# EAGLE design 18650_1S1P_PTH (EAGLE 9.6.2)
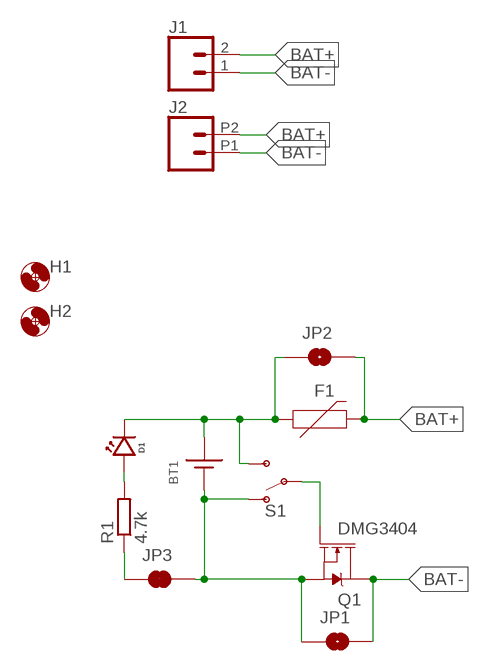
[diagram p0: schematic, sheet 1]

## Parts
BT1  18650NO_PROTEC  [BATT_18650_CLIP]
D1  LED0603  [LED_0603]
F1  PPTC1.75A1210  [1210_BOURNS]
H1  MOUNTING_HOLE4_NP  [4_40]
H2  MOUNTING_HOLE4_NP  [4_40]
J1  CONN_023.5MM_ROUND_RESTRICT  [SCREWTERMINAL-3.5MM-2_ROUND_RESTRICT]
J2  CONN_022.54_SCREW_ROUND  [1X02_2.54_SCREWTERM_ROUND]
JP1  JUMPER-SMT_2_NO_SILK  [SMT-JUMPER_2_NO_SILK]
JP2  JUMPER-SMT_2_NO_SILK  [SMT-JUMPER_2_NO_SILK]
JP3  JUMPER-SMT_2_NC_TRACE_SILK  [SMT-JUMPER_2_NC_TRACE_SILK]
Q1  DMG3404  MOSFET-NCH-DMG3404L  [SOT23-3]
R1  4.7k  R-EU_4.7KR0603  [R0603]
S1  SPDTOS1020  [OS102011MS2QN1]

## Nets
BAT+: F1.2 J1.2 J2.P2 JP2.2
BAT-: J1.1 J2.P1 JP1.2 Q1.3(D)
N$1: BT1.BATT+@1(+) BT1.BATT+@2(+) BT1.BATT+@3(+) D1.CATHODE F1.1 JP2.1 S1.3(S)
N$2: D1.ANODE R1.2
N$3: Q1.1(G) S1.2(P)
N$4: BT1.BATT-@1(-) BT1.BATT-@2(-) BT1.BATT-@3(-) JP1.1 JP3.2 Q1.2(S) S1.1(O)
N$5: JP3.1 R1.1

## Library data of the parts
BT1 = bschulz:18650: Battery Holder 18650 form factor Variant for with or without circuit protection (length varries depending on this); DIGIKEY: 36-54-ND; MF: Keystone; MPN: 54
D1 = bschulz:LED: Genaric LED
F1 = bschulz:PPTC: Bel Fuse PPTC; DIGIKEY: MF-USMF175X-2CT-ND; MF: Bourns; MPN: MF-USMF175X-2
H1 H2 = bschulz:MOUNTING_HOLE: Genaric Mechanical Mounting Hole Hole diameter based on max body diameter + 15% Keepout ring is for diameter of socket cap screw (minimum required clearance) TPlace ring is for diameter of pan head screw (recomended clearance) Specifications: Socket Cap <http://fastener-express.com/fastener-technical/SocketscapSS-Alloy.pdf> Button Head Socket Cap <http://fastener-express.com/fastener-technical/Button-Socket-alloy.pdf> Pan Head <http://fastener-express.com/fastener-technical/pan-machine-Screws.pdf>; DIGIKEY: DNP; MF: N/A; MPN: DNP
J1 = bschulz:CONN_02: Genaric 2 terminal header SCREW_2.54 <https://www.digikey.com/product-detail/en/on-shore-technology-inc/OSTVN02A150/ED10561-ND/1588862> 39532_RA <https://www.digikey.com/product-detail/en/molex/0395321002/WM7845-ND/1280696>; DIGIKEY: ED2635-ND; MF: On Shore; MPN: OSTTE020161
J2 = bschulz:CONN_02: Genaric 2 terminal header SCREW_2.54 <https://www.digikey.com/product-detail/en/on-shore-technology-inc/OSTVN02A150/ED10561-ND/1588862> 39532_RA <https://www.digikey.com/product-detail/en/molex/0395321002/WM7845-ND/1280696>; DIGIKEY: ED10561-ND; MF: OnShore; MPN: OSTVN02A150
JP1 JP2 = bschulz:JUMPER-SMT_2_NO: Normally open jumper This jumper has two pads in close proximity to each other. Apply solder to close the connection. Round pads are easier to solder for beginners, but are a lot larger. SparkFun Product that uses the round pads: SparkFun EL Sequencer <https://www.sparkfun.com/products/12781>; DIGIKEY: DNP; MF: N/A; MPN: N/A
JP3 = bschulz:JUMPER-SMT_2_NC_TRACE: Normally closed trace jumper This jumper has a trace between two pads so it's normally closed (NC). Use a razor knife to open the connection. For best results follow the IPC guidelines for cutting traces: Cutout at least 0.063 mm (0.005 in). Remove all loose material to clean up the cut area. Seal the cut with an approved epoxy. Reapply solder to reclose the connection.
Q1 = bschulz:MOSFET-NCH: N-channel MOSFETs Voltage controlled devices that allow control of high current outputs. SparkFun Products: SparkFun OpenScale <https://www.sparkfun.com/products/13261> SparkFun Digital Sandbox <https://www.sparkfun.com/products/12651> SparkFun Monster Moto Shield <https://www.sparkfun.com/products/10182> SparkFun MOSFET Power Controller <https://www.sparkfun.com/products/11214>; DIGIKEY: DMG3404L-7DICT-ND; MF: Diodes Incorporated; MPN: DMG3404L-7
R1 = bschulz_passives:R-EU_: RESISTOR, European symbol Digikey Parts: Yageo, 0402 <https://www.digikey.com/products/en/resistors/chip-resistor-surface-mount/52?k=&pkeyword=&sv=0&s=4356&sf=1&FV=-1%7C13%2C7%7C2%2C1291%7C39157%2C1989%7C0%2C-8%7C52%2C3%7C1131%2C3%7C2503&quantity=&ColumnSort=0&page=1&stock=1&pageSize=25> Yageo, 0603 <https://www.digikey.com/products/en/resistors/chip-resistor-surface-mount/52?k=&pkeyword=&sv=0&pv1291=39245&sf=1&FV=-5%7C4356%2C-5%7C47360%2C-8%7C52%2C-1%7C13%2C7%7C2%2C1989%7C0&quantity=10&ColumnSort=1000011&page=1&stock=1&pageSize=25> Panasonic, 0603 <https://www.digikey.com/products/en/resistors/chip-resistor-surface-mount/52?k=&pkeyword=&pv252=68&sf=0&FV=ffec373d%2C1c0002%2C142c040c%2C1f140000%2Cffe00034%2C80002%2Cc0001&quantity=&ColumnSort=0&page=1&stock=1&pageSize=25> Panasonic, precision, 0603 <https://www.digikey.com/products/en/resistors/chip-resistor-surface-mount/52?FV=ffec4907%2Cfffc000a%2Cc0172%2C142c040c%2C1f140000%2Cffe00034%2C1c0002&quantity=100&ColumnSort=2085&page=1&stock=1&pageSize=25> Panasonic, 0805 <https://www.digikey.com/products/en/resistors/chip-resistor-surface-mount/52?k=&pkeyword=&pv3=1&sf=0&FV=ffec373d%2C1c0002%2C1f140000%2Cffe00034%2C142c040d&quantity=&ColumnSort=0&page=1&stock=1&pageSize=25> Rohm, current sense <https://www.digikey.com/products/en/resistors/chip-resistor-surface-mount/52?k=&pkeyword=&pv3=1&sf=0&FV=ffecb688%2C1f140000%2Cffe00034%2C1c0002&quantity=&ColumnSort=0&page=1&stock=1&pageSize=25> Vishay, pulse proof automotive <https://www.digikey.com/products/en/resistors/chip-resistor-surface-mount/52?k=&pkeyword=&pv7=2&sf=0&FV=ffec5d6b%2Cffe00034%2C1f140000&quantity=&ColumnSort=0&page=1&stock=1&pageSize=25>; DIGIKEY: 311-4.70KHRCT-ND; MF: Yageo; MPN: RC0603FR-074K7L; VALUE_PART: 4.7k
S1 = bschulz:SPDT: Genaric SPDT switch

## Board
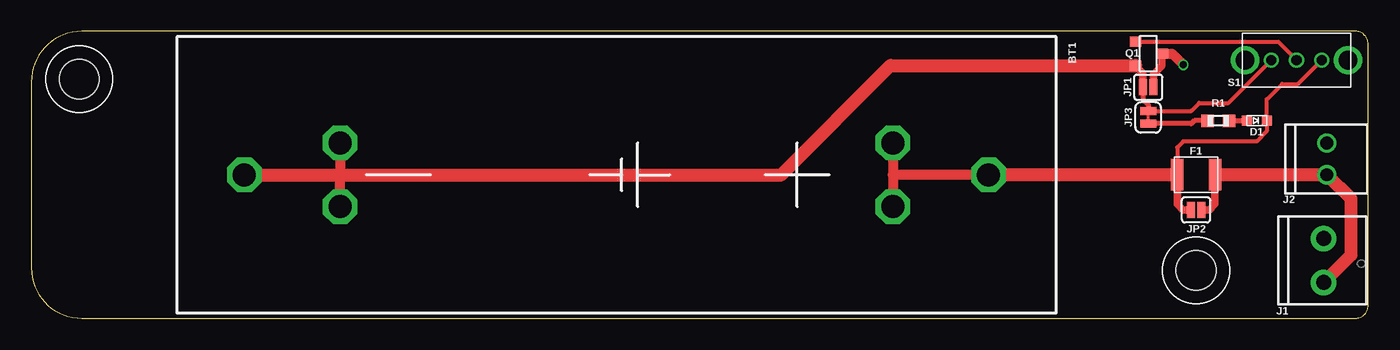
[diagram p1: board, top side]
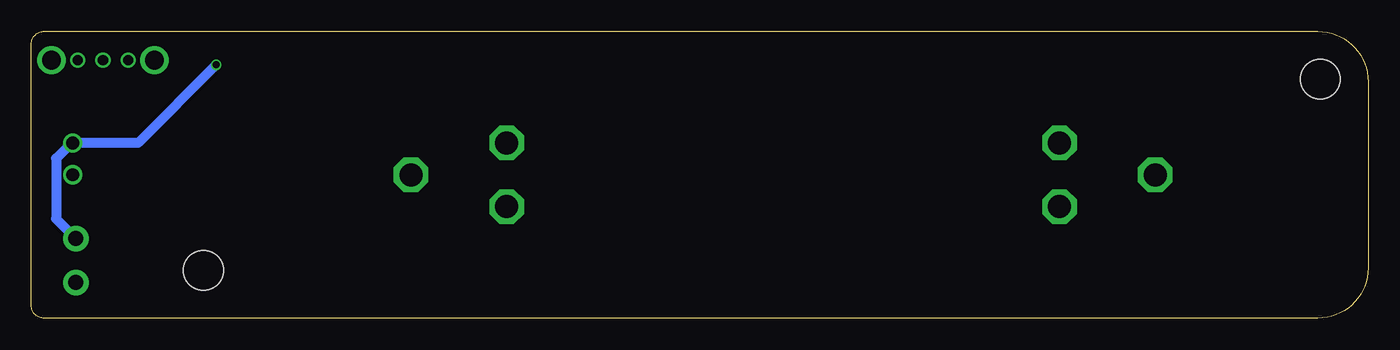
[diagram p2: board, bottom side, seen from below]

Size 106.41 x 22.86 mm. Coordinates in mm from the lower left corner, seen from the top.
Outline: 0,18.86 0,4 arc90 4,0 105.41,0 arc90 106.41,1 106.41,21.86 arc90 105.41,22.86 4,22.86 arc90 0,18.86
Copper layers (1*16): Top 0.035559375mm / dielectric 1.6mm / Bottom 0.035559375mm
Design rules "oshpark-2layer": minimum track width 6mil, minimum drill 10mil, track to track 6mil, track to pad 6mil, pad to pad 6mil, via to via 6mil, smd to smd 6mil, copper to edge 15mil, drill to drill 6mil, minimum pad ring 5mil, minimum via ring 5mil, stop-mask expansion 2.5mil, vias tented up to drill 0mil, thermal gap 10mil

### Footprints (pad centres in the part's own frame; a part is rotated, then mirrored left to right if it is on the bottom)
BATT_18650_CLIP = drill 1.83 octagon: BATT+@1 0,0; BATT+@2 7.62,2.54; BATT+@3 7.62,-2.54; BATT-@1 59.246,0; BATT-@2 51.626,2.54; BATT-@3 51.626,-2.54
LED_0603 = smd 0.8 x 0.8: ANODE 0.8,0; CATHODE -0.8,0
1210_BOURNS = smd 1 x 2.5: 1 -1.5,0; 2 1.5,0
4_40 = hole 3.175: 0,0
SCREWTERMINAL-3.5MM-2_ROUND_RESTRICT = drill 1.2 pad 2.032: 1 0,0; 2 3.5,0
1X02_2.54_SCREWTERM_ROUND = drill 1.016: P1 1.27,0; P2 -1.27,0
SMT-JUMPER_2_NO_SILK = smd 0.635 x 1.27: 1 -0.406,0; 2 0.406,0
SMT-JUMPER_2_NC_TRACE_SILK = smd 0.635 x 1.27: 1 -0.508,0; 2 0.508,0
SOT23-3 = smd 0.8 x 0.9: 1 -0.95,-1; 2 0.95,-1; 3 0,1.1
R0603 = smd 1 x 1: 1 -0.85,0; 2 0.85,0
OS102011MS2QN1 = drill 0.8: 1 -2,0; 2 0,0; 3 2,0 | drill 1.5: BODY@1 -4.1,0; BODY@2 4.1,0

### Placement (x,y rotation side)
BT1  76.2,11.43 180 top
D1  97.54,15.75 180 top
F1  92.71,11.43 0 top
H1  92.71,3.81 0 top
H2  3.81,19.05 0 top
J1  102.87,6.35 270 top
J2  103.12,12.7 90 top
JP1  88.9,18.41 0 top
JP2  92.71,8.64 0 top
JP3  88.9,16 90 top
Q1  88.9,21.08 270 top
R1  94.49,15.75 0 top
S1  100.71,20.57 0 top

### Tracks (layer width: path | path; a pad name or v marks a point on that pad's centre or on a via)
BAT+
  Top 0.61: JP2.2 93.75,8.64 94.21,9.1 F1.2
  Top 1.016: F1.2 J2.P2 105.03,9.53 105.03,5.01 J1.2
BAT-  (via drill 0.55)
  Top 0.61: JP1.2 89.31,19.43 90,20.12 Q1.3
  Top 0.813: Q1.3 90.81,21.08 v91.69,20.19
  Bottom 0.813: v91.69,20.19 97.92,13.97 J2.P1 103.21,13.97 104.44,12.74 104.44,7.92 J1.1
N$1
  Top 0.305: F1.1 91.21,13.61 91.69,14.1 97.54,14.1 98.34,14.9 D1.CATHODE 98.34,17.44 99.57,18.67 100.81,18.67 S1.3
  Top 0.61: JP2.1 91.67,8.64 91.21,9.1 F1.1
  Top 0.813: BT1.BATT+@3 68.58,11.43 | 68.58,11.43 BT1.BATT+@2 | BT1.BATT+@1 68.58,11.43
  Top 1.016: F1.1 BT1.BATT+@1
N$2
  Top 0.406: R1.2 D1.ANODE
N$3
  Top 0.305: Q1.1 87.93,22 99.28,22 S1.2
N$4
  Top 0.305: JP3.2 92.33,16.51 92.96,17.14 95.28,17.14 S1.1
  Top 0.406: JP1.1 88.49,17.42 88.9,17.02 JP3.2
  Top 0.61: JP1.1 88.49,19.54 Q1.2
  Top 0.813: BT1.BATT-@3 24.57,11.49 | 24.57,11.49 24.64,11.43 | BT1.BATT-@2 24.57,11.49
  Top 1.016: Q1.2 68.39,20.13 59.69,11.43 24.64,11.43 BT1.BATT-@1
N$5
  Top 0.406: R1.1 92.58,15.75 92.33,15.49 JP3.1

### Text on the board
tDocu: OFF | ON | - | + | - | +
bDocu: 1S1P - 18650 - PTH / Project Gonk / Bobby Schulz / v0.0